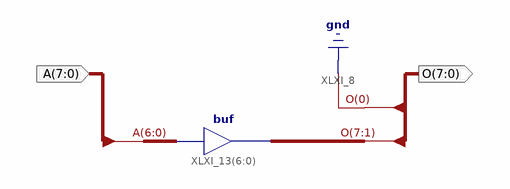
[diagram p0: schematic sheet 1]
// Xilinx ISE schematic SHL8Bits_Bus.sch (spartan6) as structural Verilog: 1 symbols, 2 ports
module SHL8Bits_Bus (
  input  [7:0] A,
  output [7:0] O
);

  assign O[7:1] = A[6:0];  // buf XLXI_13[6..0], 7 bits wide

  assign O[0] = 1'b0;
endmodule
